# EAGLE design predkosciomierz (EAGLE 5.10)
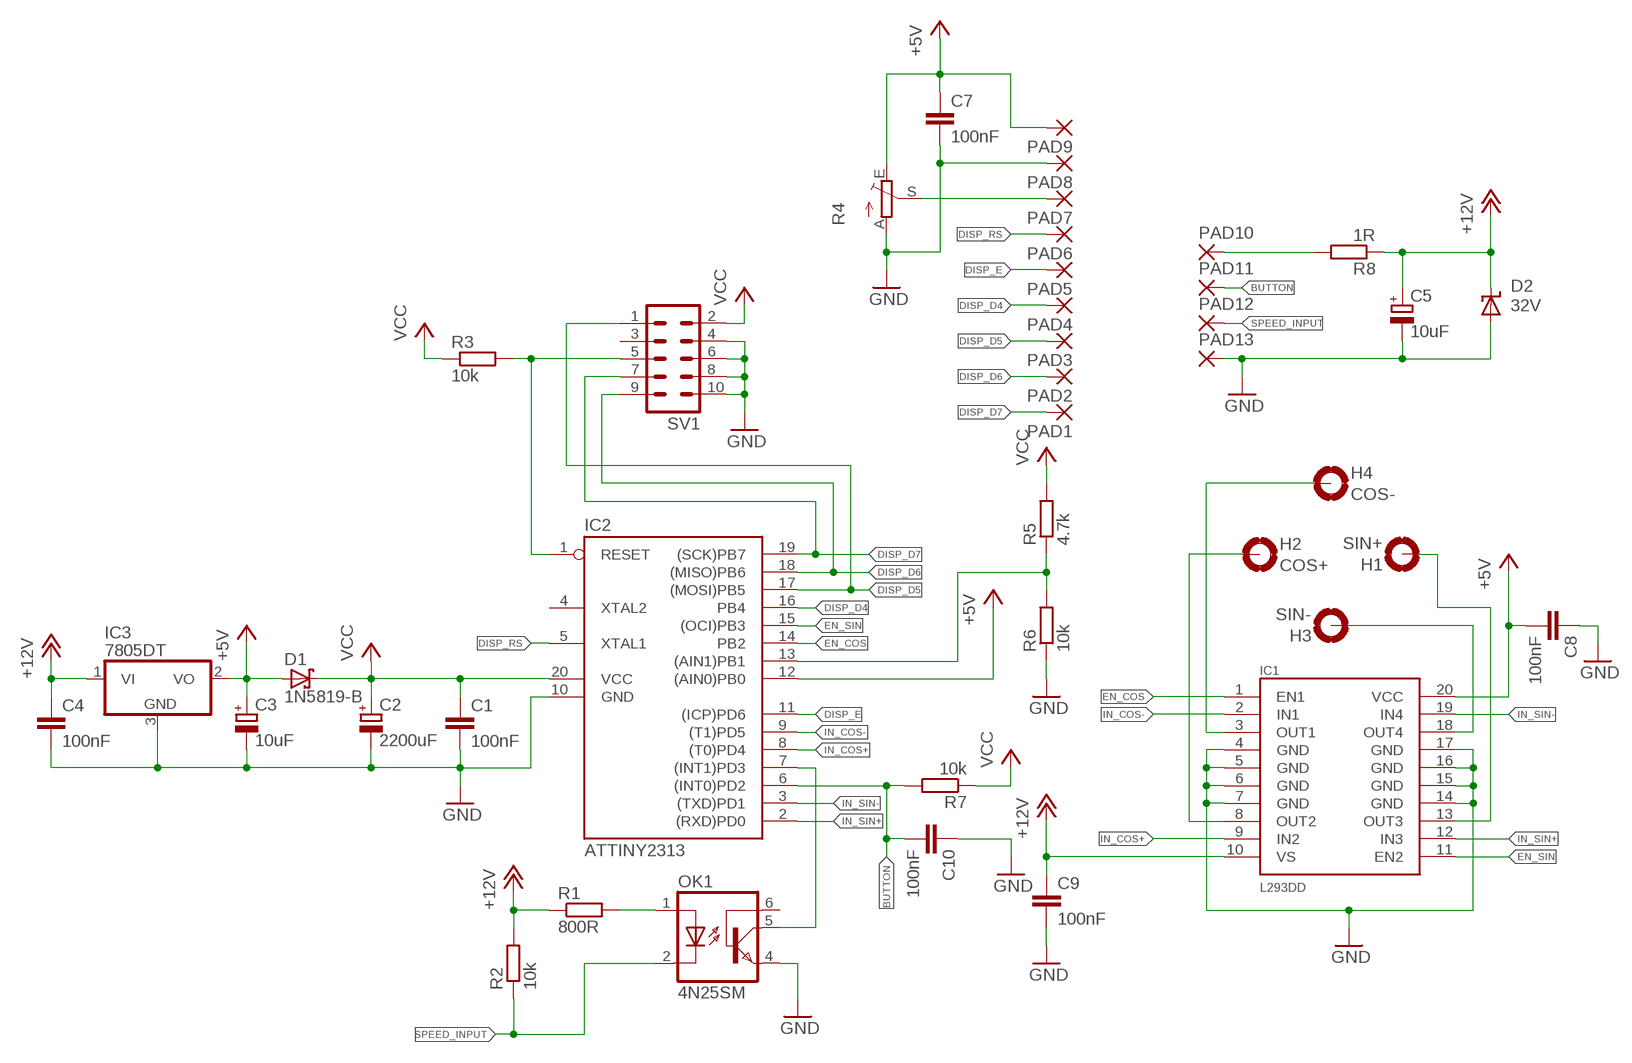
[diagram p0: schematic, sheet 1]

## Parts
C1  100nF  C-EUC0805  [C0805]
C2  2200uF  CPOL-EUE7.5-16  [E7,5-16]
C3  10uF  CPOL-EUE2.5-5  [E2,5-5]
C4  100nF  C-EUC0805  [C0805]
C5  10uF  CPOL-EUE2.5-5  [E2,5-5]
C7  100nF  C-EUC0805  [C0805]
C8  100nF  C-EUC0805  [C0805]
C9  100nF  C-EUC0805  [C0805]
C10  100nF  C-EUC0805  [C0805]
D1  1N5819-B  [DO41-7.6]
D2  32V  SUPPRESSOR-SMBJ  [SMBJ]
H1  SIN+  MOUNT-PAD-ROUND2.8  [2,8-PAD]
H2  COS+  MOUNT-PAD-ROUND2.8  [2,8-PAD]
H3  SIN-  MOUNT-PAD-ROUND2.8  [2,8-PAD]
H4  COS-  MOUNT-PAD-ROUND2.8  [2,8-PAD]
IC1  L293DD  [SO20]
IC2  ATTINY2313  AT90S2313S  [SO20L]
IC3  7805DT  [TO252]
OK1  4N25SM  [DIL6-SMD]
PAD1  WIREPAD3,17/1,2  [3,17/1,2]
PAD2  WIREPAD3,17/1,2  [3,17/1,2]
PAD3  WIREPAD3,17/1,2  [3,17/1,2]
PAD4  WIREPAD3,17/1,2  [3,17/1,2]
PAD5  WIREPAD3,17/1,2  [3,17/1,2]
PAD6  WIREPAD3,17/1,2  [3,17/1,2]
PAD7  WIREPAD3,17/1,2  [3,17/1,2]
PAD8  WIREPAD3,17/1,2  [3,17/1,2]
PAD9  WIREPAD3,17/1,2  [3,17/1,2]
PAD10  WIREPAD3,17/1,2  [3,17/1,2]
PAD11  WIREPAD3,17/1,2  [3,17/1,2]
PAD12  WIREPAD3,17/1,2  [3,17/1,2]
PAD13  WIREPAD3,17/1,2  [3,17/1,2]
R1  800R  R-EU_R0805  [R0805]
R2  10k  R-EU_R0805  [R0805]
R3  10k  R-EU_R0805  [R0805]
R4  TRIM_EU-LI10  [LI10]
R5  4.7k  R-EU_R0805  [R0805]
R6  10k  R-EU_R0805  [R0805]
R7  10k  R-EU_R0805  [R0805]
R8  1R  R-EU_R1206  [R1206]
SV1  ML10  [ML10]

## Nets
+5V: C3.+ C7.1 C8.2 D1.A IC1.20(VCC) IC2.12((AIN0)PB0) IC3.2(VO) PAD9.1(P) R4.E
+12V: C4.1 C5.+ C9.1 D2.C IC1.10(VS) IC3.1(VI) R1.1 R2.2 R8.1
BUTTON: C10.2 IC2.6((INT0)PD2) PAD11.1(P) R7.2
DISP_D4: IC2.16(PB4) PAD4.1(P)
DISP_D5: IC2.17((MOSI)PB5) PAD3.1(P) SV1.1
DISP_D6: IC2.18((MISO)PB6) PAD2.1(P) SV1.9
DISP_D7: IC2.19((SCK)PB7) PAD1.1(P) SV1.7
DISP_E: IC2.11((ICP)PD6) PAD5.1(P)
DISP_RS: IC2.5(XTAL1) PAD6.1(P)
EN_COS: IC1.1(EN1) IC2.14(PB2)
EN_SIN: IC1.11(EN2) IC2.15((OCI)PB3)
GND: C1.2 C2.- C3.- C4.2 C5.- C7.2 C8.1 C9.2 C10.1 D2.A IC1.4(GND) IC1.5(GND) IC1.6(GND) IC1.7(GND) IC1.14(GND) IC1.15(GND) IC1.16(GND) IC1.17(GND) IC2.10(GND) IC3.3(GND) OK1.4(EMI) PAD8.1(P) PAD13.1(P) R4.A R6.1 SV1.4 SV1.6 SV1.8 SV1.10
IN_COS+: IC1.9(IN2) IC2.8((T0)PD4)
IN_COS-: IC1.2(IN1) IC2.9((T1)PD5)
IN_SIN+: IC1.12(IN3) IC2.2((RXD)PD0)
IN_SIN-: IC1.19(IN4) IC2.3((TXD)PD1)
N$1: PAD10.1(P) R8.2
N$2: IC2.7((INT1)PD3) OK1.5(COL)
N$3: IC2.1(RESET) R3.2 SV1.5
N$4: PAD7.1(P) R4.S
N$5: H2.B2,8(MOUNT) IC1.8(OUT2)
N$6: OK1.1(A) R1.2
N$7: H4.B2,8(MOUNT) IC1.3(OUT1)
N$8: H3.B2,8(MOUNT) IC1.18(OUT4)
N$9: H1.B2,8(MOUNT) IC1.13(OUT3)
N$14: IC2.13((AIN1)PB1) R5.1 R6.2
SPEED_INPUT: OK1.2(C) PAD12.1(P) R2.1
VCC: C1.1 C2.+ D1.C IC2.20(VCC) R3.1 R5.2 R7.1 SV1.2
Unconnected: IC2.4(XTAL2) OK1.6(BAS) SV1.3

## Library data of the parts
C1 C4 C7-C10 = resistor:C-EU: CAPACITOR, European symbol
C2 C3 C5 = rcl:CPOL-EU: POLARIZED CAPACITOR, European symbol
D1 = diode:1N581*: 1.0A SCHOTTKY BARRIER RECTIFIER Source: http://www.diodes.com/datasheets/ds23001.pdf
D2 = diode:SUPPRESSOR-: Suppressor diode
H1-H4 = holes:MOUNT-PAD-ROUND: MOUNTING PAD, round
IC1 = moja:L293DD
IC2 = atmel:AT90S2313: MICROCONTROLLER 2 Kbytes FLASH 128 bytes SRAM 128 bytes EEPROM UART; OC_FARNELL: unknown; OC_NEWARK: unknown
IC3 = linear:78*: Positive VOLTAGE REGULATOR Source: http://cache.national.com/ds/LM/LM78L05.pdf http://www.fairchildsemi.com/ds/LM/LM7805.pdf
OK1 = optocoupler:4N*?M: General Purpose 6-Pin Phototransistor Optocouplers Source: http://www.fairchildsemi.com/ds/4N/4N35-M.pdf; MF: FAIRCHILD SEMICONDUCTOR; MPN: 4N25SM; OC_FARNELL: 1021152; OC_NEWARK: 34C2020
PAD1-PAD13 = wirepad:WIREPAD: Wire PAD connect wire on PCB
R1-R3 R5-R8 = rcl:R-EU_: RESISTOR, European symbol
R4 = pot:TRIM_EU-: POTENTIOMETER
SV1 = con-harting-ml:ML10: HARTING; OC_FARNELL: unknown; OC_NEWARK: unknown

## Board
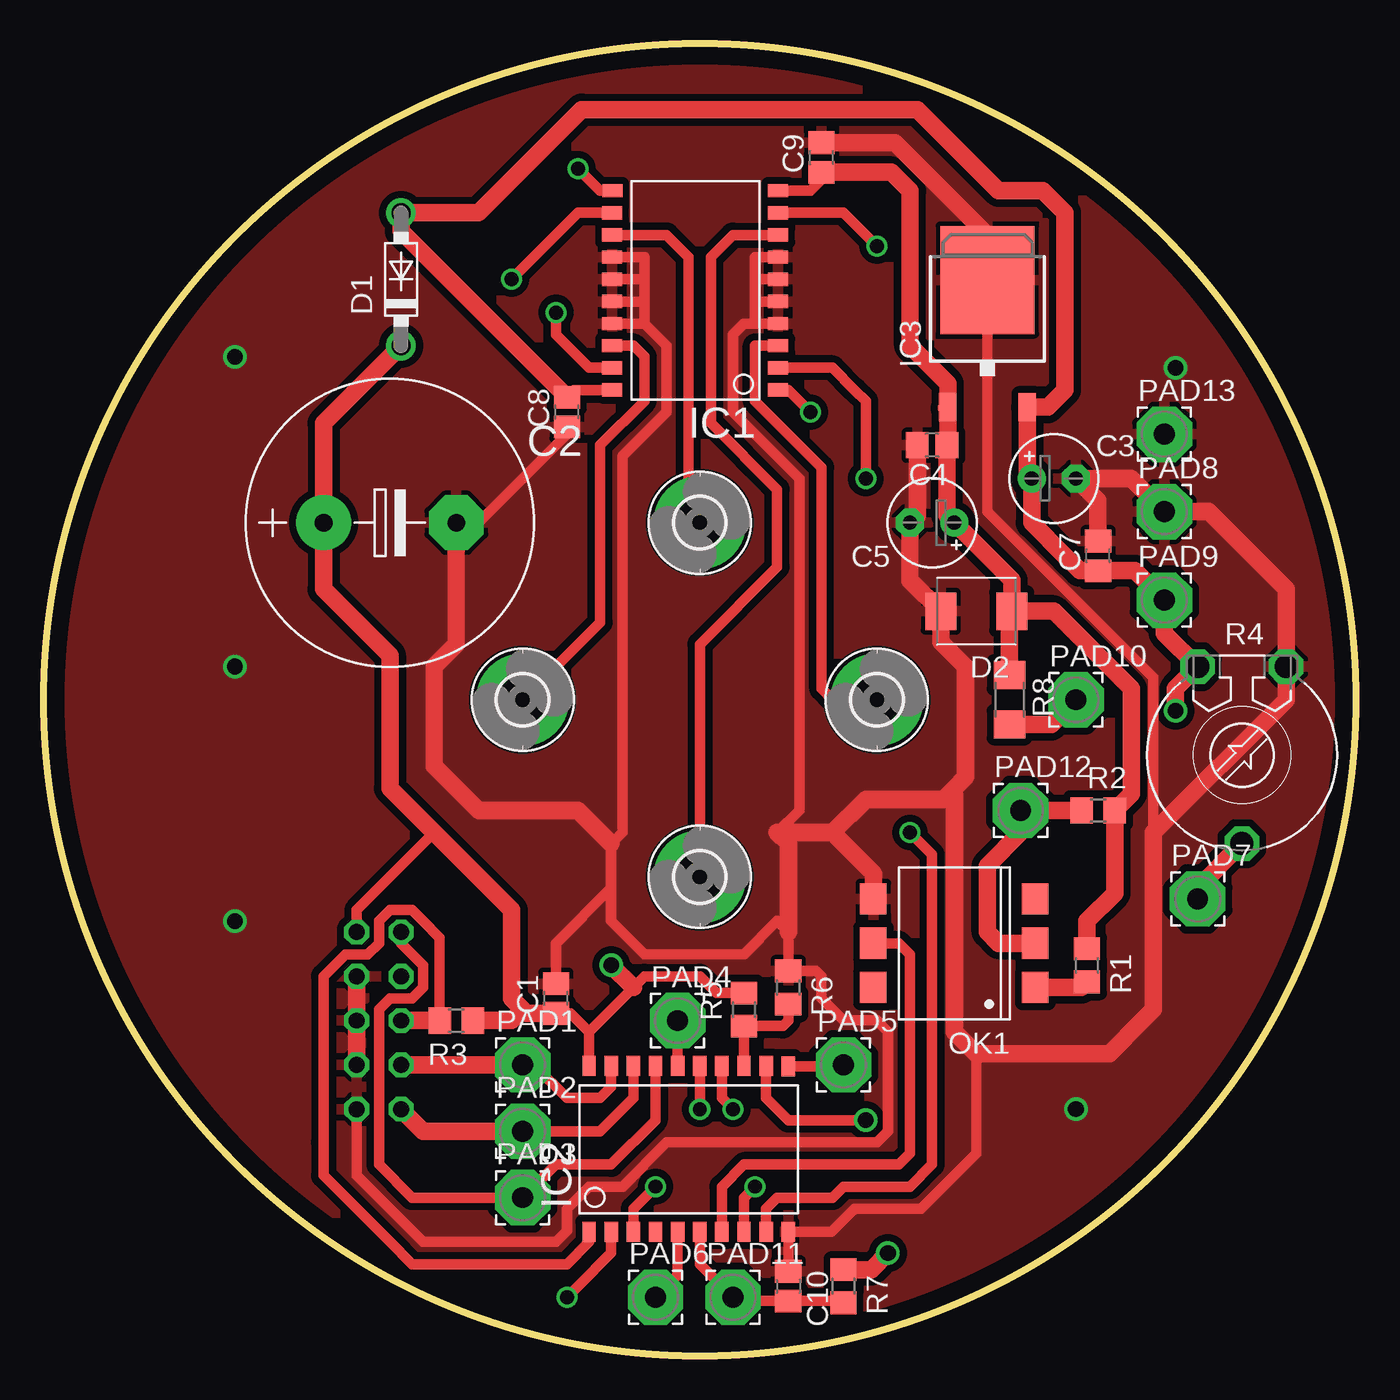
[diagram p1: board, top side]
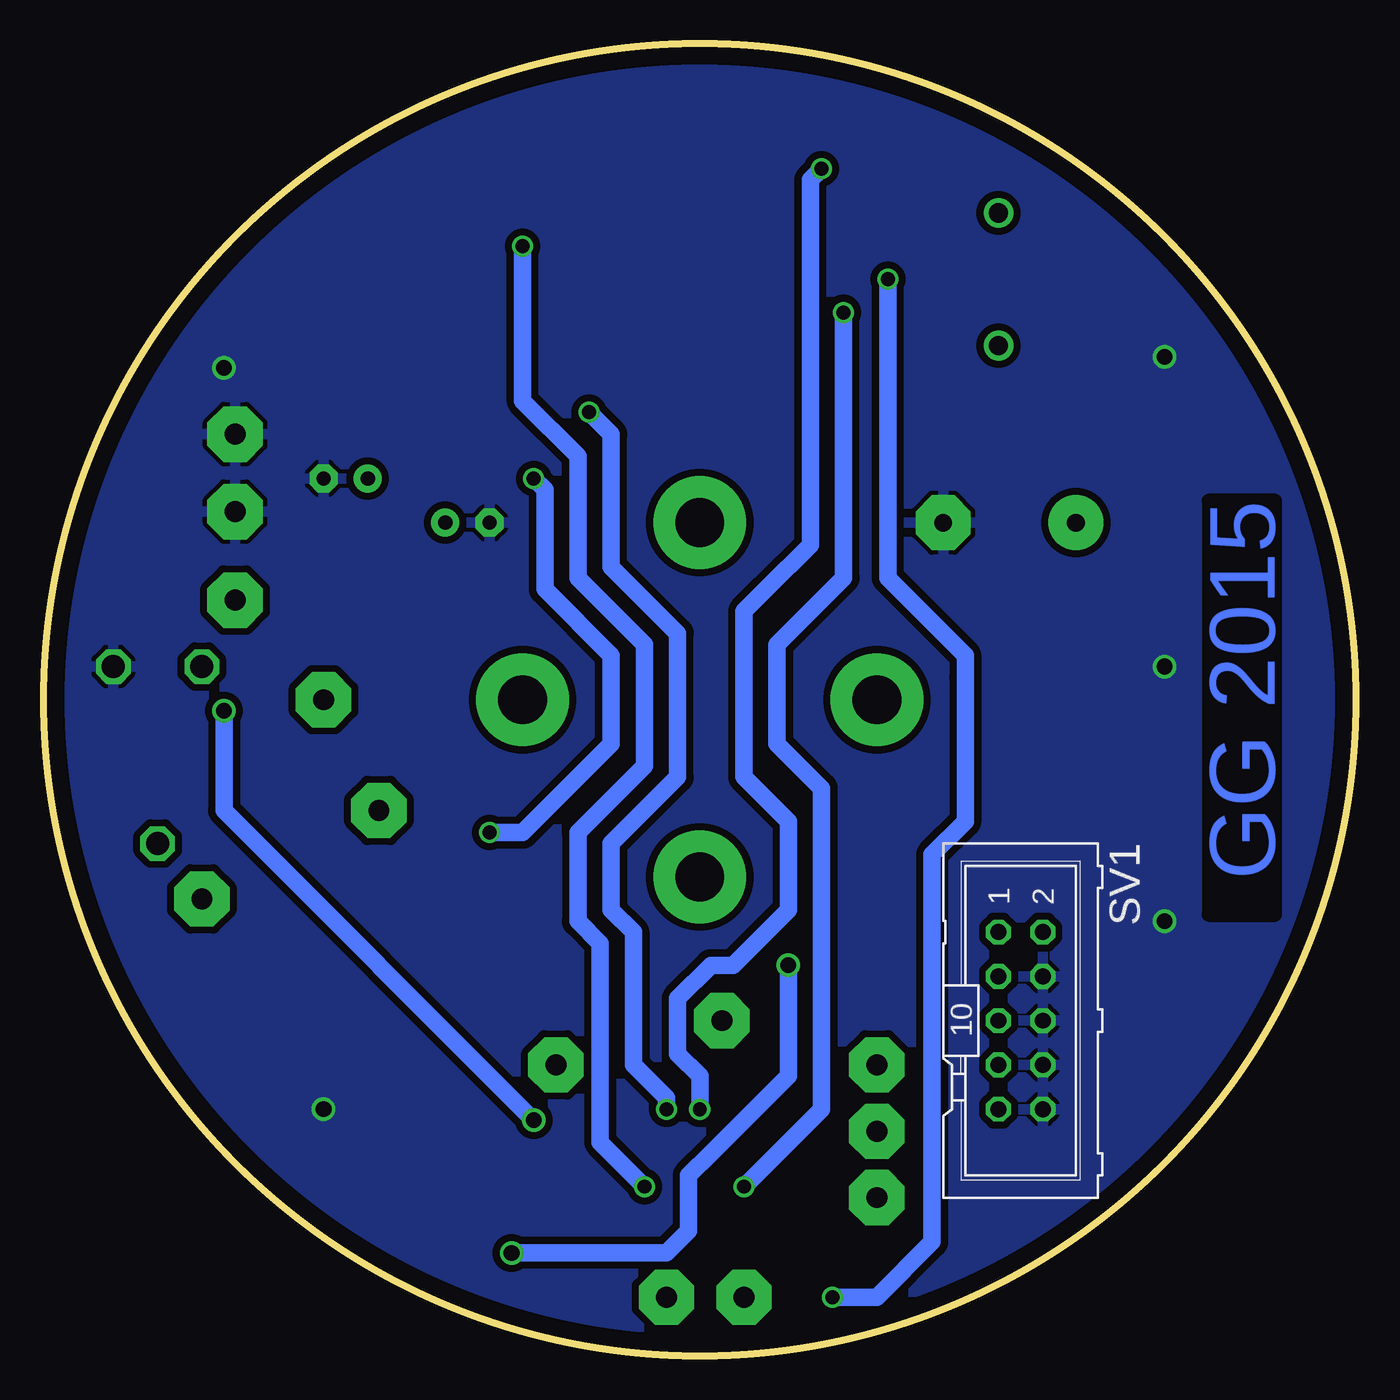
[diagram p2: board, bottom side, seen from below]

Size 75.32 x 75.32 mm. Coordinates in mm from the lower left corner, seen from the top.
Outline: circle at 37.66,37.66 radius 37.66
Copper layers (1*16): Top 0.035mm / dielectric 1.5mm / Bottom 0.035mm
Design rules "default": minimum track width 10mil, minimum drill 24mil, track to track 8mil, track to pad 8mil, pad to pad 8mil, via to via 8mil, smd to smd 8mil, copper to edge 40mil, drill to drill 8mil, minimum pad ring 10mil, minimum via ring 8mil, stop-mask expansion 4mil, vias tented up to drill 0mil, thermal gap 10mil

### Footprints (pad centres in the part's own frame; a part is rotated, then mirrored left to right if it is on the bottom)
C0805 = smd 1.3 x 1.5: 1 -0.85,0; 2 0.85,0
E7,5-16 = drill 1.016 pad 3.15 round: + -3.81,0 | drill 1.016 pad 3.15 octagon: - 3.81,0
E2,5-5 = drill 0.813 pad 1.6 round: + -1.27,0 | drill 0.813 pad 1.6 octagon: - 1.27,0
DO41-7.6 = drill 1.1 pad 1.7 round: A 3.81,0; C -3.81,0
SMBJ = smd 1.78 x 2.16: A 2.04,0; C -2.03,0
2,8-PAD = drill 2.8 pad 5.334 round: B2,8 0,0
SO20 = smd 0.762 x 1.143: 1 -5.08,-5.131; 2 -3.81,-5.131; 3 -2.54,-5.131; 4 -1.27,-5.131; 5 0,-5.131; 6 1.27,-5.131; 7 2.54,-5.131; 8 3.81,-5.131; 9 5.08,-5.131; 10 6.35,-5.131; 11 6.35,4.369; 12 5.08,4.394; 13 3.81,4.394; 14 2.54,4.394; 15 1.27,4.394; 16 0,4.394; 17 -1.27,4.394; 18 -2.54,4.394; 19 -3.81,4.394; 20 -5.08,4.394
SO20L = smd 0.762 x 1.143: 1 -5.08,-5.131; 2 -3.81,-5.131; 3 -2.54,-5.131; 4 -1.27,-5.131; 5 0,-5.131; 6 1.27,-5.131; 7 2.54,-5.131; 8 3.81,-5.131; 9 5.08,-5.131; 10 6.35,-5.131; 11 6.35,4.369; 12 5.08,4.394; 13 3.81,4.394; 14 2.54,4.394; 15 1.27,4.394; 16 0,4.394; 17 -1.27,4.394; 18 -2.54,4.394; 19 -3.81,4.394; 20 -5.08,4.394
TO252 = smd 1 x 1.6: 1 -2.28,-4.8; 2 2.28,-4.8 | smd 5.4 x 6.2: 3 0,2.5
DIL6-SMD = smd 1.78 x 1.52: 1 -2.54,-4.645; 2 0,-4.645; 3 2.54,-4.645; 4 2.54,4.645; 5 0,4.645; 6 -2.54,4.645
3,17/1,2 = drill 1.194 pad 3.175 octagon: 1 0,0
R0805 = smd 1.3 x 1.5: 1 -0.95,0; 2 0.95,0
LI10 = drill 1.321 octagon: A -2.54,-5.08; E 2.54,-5.08; S 0,5.08
R1206 = smd 1.6 x 1.803: 1 -1.422,0; 2 1.422,0
ML10 = drill 0.914 octagon: 1 -5.08,-1.27; 2 -5.08,1.27; 3 -2.54,-1.27; 4 -2.54,1.27; 5 0,-1.27; 6 0,1.27; 7 2.54,-1.27; 8 2.54,1.27; 9 5.08,-1.27; 10 5.08,1.27

### Placement (x,y rotation side)
C1  29.4,20.51 90 top
C2  19.88,47.82 0 top
C3  57.98,50.36 0 top
C4  50.99,52.26 180 top
C5  50.99,47.82 180 top
C7  60.52,45.91 90 top
C8  30.04,54.17 90 top
C9  44.64,68.77 90 top
C10  42.74,4 270 top
D1  20.51,61.79 90 top
D2  53.53,42.74 180 top
H1  37.66,47.82 0 top
H2  37.66,27.5 0 top
H3  27.5,37.66 0 top
H4  47.82,37.66 0 top
IC1  37.02,60.52 90 top
IC2  36.39,12.26 0 top
IC3  54.17,59.25 0 top
OK1  52.26,23.69 90 top
PAD1  27.5,16.7 0 top
PAD2  27.5,12.89 0 top
PAD3  27.5,9.08 0 top
PAD4  36.39,19.24 0 top
PAD5  45.91,16.7 0 top
PAD6  35.12,3.37 0 top
PAD7  66.23,26.23 0 top
PAD8  64.33,48.45 0 top
PAD9  64.33,43.37 0 top
PAD10  59.25,37.66 0 top
PAD11  39.56,3.37 0 top
PAD12  56.07,31.31 0 top
PAD13  64.33,52.9 0 top
R1  59.88,22.42 270 top
R2  60.52,31.31 0 top
R3  23.69,19.24 180 top
R4  68.77,34.48 180 top
R5  40.2,19.88 90 top
R6  42.74,21.15 270 top
R7  45.91,4 270 top
R8  55.44,37.66 270 top
SV1  19.24,19.24 270 bottom

### Tracks (layer width: path | path; a pad name or v marks a point on that pad's centre or on a via)
+5V  (via drill 0.9)
  Top 0.61: IC2.12 41.47,14.8 42.74,13.53 v47.18,13.53 | C8.2 30.46,55.44 IC1.20
  Top 1.016: v64.96,37.02 64.96,38.29 R4.E 64.33,41.47 PAD9.1 62.64,45.06 C7.1 59.46,45.06 58.61,45.91 56.71,47.82 C3.+ 56.45,50.62 IC3.2 57.62,54.45 57.98,54.8 58.61,55.44 58.61,65.6 57.34,66.87 54.8,66.87 50.14,71.53 30.89,71.53 26.23,66.87 24.96,65.6 D1.A 20.51,64.54 C8.2
  Bottom 1.016: v47.18,13.53 64.96,31.31 v64.96,37.02
+12V
  Top 0.61: IC1.10 44.01,66.87 44.64,67.5 C9.1
  Top 1.016: IC3.1 51.82,54.38 | D2.C 55.56,44.52 C5.+ 51.84,48.24 C4.1 51.89,52.31 IC3.1 | R8.1 55.44,42.61 D2.C | D2.C 57.98,42.74 62.42,38.29 62.42,32.26 R2.2 61.47,26.54 59.88,24.96 R1.1 | IC3.1 51.89,55.81 49.72,57.98 49.72,66.87 48.67,67.92 C9.1
BUTTON
  Top 0.61: IC2.6 37.66,5.27 PAD11.1 39.78,3.15 C10.2 45.81,3.15 R7.2
DISP_D4
  Top 0.61: PAD4.1 IC2.16
DISP_D5
  Top 0.61: IC2.17 35.12,13.53 32.58,10.99 29.4,10.99 PAD3.1 21.15,9.08 19.24,10.99 19.24,19.88 19.88,20.51 21.15,20.51 21.78,21.15 21.78,22.42 21.15,23.05 20.51,23.69 SV1.1
DISP_D6
  Top 0.61: PAD2.1 31.94,12.89 33.85,14.8 IC2.18
  Top 1.016: SV1.9 21.78,12.89 PAD2.1
DISP_D7
  Top 0.61: PAD1.1 28.13,16.7 30.04,14.8 31.94,14.8 32.58,15.43 IC2.19
  Top 1.016: PAD1.1 SV1.7
DISP_E
  Top 0.61: PAD5.1 45.84,16.63 IC2.11
DISP_RS
  Top 0.61: PAD6.1 36.39,4.64 IC2.5
EN_COS  (via drill 0.8)
  Top 0.61: IC2.14 38.93,14.8 v39.56,14.16 | v44.01,54.17 42.74,55.44 IC1.1
  Bottom 1.016: v39.56,14.16 39.56,14.8 41.47,16.7 41.47,24.32 42.74,25.59 42.74,29.4 38.93,33.21 38.93,41.47 42.74,45.28 42.74,52.9 v44.01,54.17
EN_SIN  (via drill 0.8)
  Top 0.61: IC1.11 31.94,66.87 v30.67,68.14 | v37.66,14.16 IC2.15
  Bottom 1.016: v30.67,68.14 31.31,67.5 31.31,46.55 33.85,44.01 35.12,42.74 35.12,33.21 32.58,30.67 32.58,25.59 35.75,22.42 37.02,22.42 38.93,20.51 38.93,17.34 37.66,16.07 v37.66,14.16
GND  (via drill 0.9)
  Top 0.61: 32.58,26.86 32.58,24.96 34.48,23.05 38.93,23.05 40.2,23.05 42.1,24.96 42.74,24.32 R6.1 44.33,22.1 44.64,21.78 44.64,20.51 45.91,19.24 47.82,19.24 48.45,18.61 48.45,17.34 48.45,12.89 47.82,12.26 46.55,12.26 35.75,12.26 33.21,9.72 31.31,9.72 30.04,8.45 30.04,7.18 29.4,6.54 21.78,6.54 17.97,10.35 SV1.10 | 32.58,26.86 32.58,29.4 33.21,30.04 33.21,51.63 35.75,54.17 35.75,57.98 34.48,59.25 | C1.2 29.4,23.69 32.58,26.86 | C10.1 IC2.10 45.23,7.13 46.55,8.45 50.36,8.45 53.53,11.62 53.53,17.34 | 34.48,60.52 IC1.16 | 34.48,59.25 34.48,60.52 | 34.48,59.25 IC1.17 | 34.48,61.79 IC1.15 | 34.48,60.52 34.48,61.79 | 34.48,63.06 IC1.14 | 34.48,63.06 34.48,61.79 | IC1.7 40.83,63.06 40.83,61.79 | 40.83,59.25 40.83,60.52 | 40.83,60.52 40.83,61.79 | 40.83,59.25 IC1.4 | 40.83,61.79 IC1.6 | 40.83,60.52 IC1.5 | 34.48,59.25 34.48,63.06 | 40.83,59.25 40.2,59.25 39.56,58.61 39.56,54.17 43.37,50.36 43.37,31.31 42.1,30.04 | IC3.3 54.17,48.45 59.25,43.37 63.69,38.93 63.69,30.04 | C8.1 30.04,52.9 24.96,47.82 C2.-
  Top 1.016: C4.2 50.14,48.24 C5.- 49.72,44.64 49.72,44.51 D2.A 51.49,40.97 52.9,39.56 52.9,33.21 52.26,32.58 | OK1.4 47.62,27.7 47.5,27.82 45.28,30.04 | C7.2 60.52,49.09 C3.- 62.42,50.36 PAD8.1 66.87,48.45 71.31,44.01 R4.A 71.31,37.66 63.69,30.04 63.69,19.88 63.06,19.24 61.15,17.34 53.53,17.34 52.26,18.61 52.26,32.58 | C2.- 23.69,40.83 22.42,39.56 22.42,33.85 24.96,31.31 30.67,31.31 32.58,29.4 | IC3.3 54.17,64.33 48.87,69.62 C9.2 | SV1.4 SV1.6 SV1.8 | 45.28,30.04 47.18,31.94 51.63,31.94 52.26,32.58 | 45.28,30.04 42.1,30.04 42.74,29.4 42.74,24.32
  other vias: 64.96,56.71 59.25,14.16 10.99,57.34 10.99,39.56 10.99,24.96
  pour Bottom (isolate 0.406): -4.25,77.66 76.39,77.66 76.39,-7.43 -4.25,-7.43
  pour Top (isolate 0.406): -2.35,76.39 77.03,76.39 77.03,-4.89 -2.35,-4.89
IN_COS+  (via drill 0.8)
  Top 0.61: IC2.8 40.2,9.08 v40.83,9.72 | v47.82,63.69 45.91,65.6 IC1.9
  Bottom 1.016: v40.83,9.72 43.37,12.26 43.37,17.97 43.37,23.69 44.64,24.96 44.64,30.04 40.83,33.85 40.83,40.83 44.64,44.64 44.64,51.63 47.82,54.8 v47.82,63.69
IN_COS-  (via drill 0.8)
  Top 0.61: IC1.2 45.28,56.71 46.55,55.44 47.18,54.8 v47.18,50.36 | IC2.9 41.47,8.45 42.1,9.08 44.64,9.08 45.28,9.08 45.91,9.72 49.72,9.72 50.99,10.99 50.99,28.77 v49.72,30.04
  Bottom 1.016: v47.18,50.36 46.55,49.72 46.55,44.01 42.74,40.2 42.74,35.12 47.82,30.04 v49.72,30.04
IN_SIN+  (via drill 0.8)
  Top 0.61: IC2.2 32.58,5.91 30.67,4 v30.04,3.37 | v26.86,61.79 30.67,65.6 IC1.12
  Bottom 1.016: v30.04,3.37 27.5,3.37 24.32,6.54 24.32,19.24 24.32,28.77 22.42,30.67 22.42,38.93 22.42,40.2 26.86,44.64 26.86,56.71 v26.86,61.79
IN_SIN-  (via drill 0.8)
  Top 0.61: IC2.3 33.85,8.45 v35.12,9.72 | v29.4,59.88 29.4,58.61 31.31,56.71 IC1.19
  Bottom 1.016: v35.12,9.72 30.67,14.16 30.67,24.32 30.67,32.58 33.21,35.12 33.21,40.83 29.4,44.64 v29.4,59.88
N$1
  Top 1.016: R8.2 57.83,36.24 PAD10.1
N$2
  Top 0.61: IC2.7 38.93,9.72 40.2,10.99 47.18,10.99 49.09,10.99 49.72,11.62 49.72,23.05 49.09,23.69 OK1.5
N$3
  Top 0.61: 31.31,6.54 IC2.1 31.31,6.54 | R3.2 22.74,24 21.78,24.96 21.15,25.59 20.51,25.59 19.88,25.59 19.24,24.96 19.24,24.32 19.24,23.69 18.61,23.05 17.34,23.05 16.07,21.78 16.07,12.26 16.07,10.35 19.88,6.54 21.15,5.27 30.04,5.27 31.31,6.54
  Top 1.016: R3.2 SV1.5
N$4
  Top 1.016: PAD7.1 66.23,26.86 R4.S
N$5
  Top 0.61: H2.B2,8 37.66,40.83 42.1,45.28 42.1,49.72 38.29,53.53 38.29,63.06 39.56,64.33 IC1.8
N$6
  Top 1.016: OK1.1 59.56,21.15 R1.2
N$7
  Top 0.61: H4.B2,8 45.28,37.66 44.64,38.29 44.64,50.99 40.83,54.8 40.83,57.98 IC1.3
N$8
  Top 0.61: H3.B2,8 31.94,42.1 31.94,52.26 34.48,54.8 34.48,57.34 33.85,57.98 IC1.18
N$9
  Top 0.61: IC1.13 35.12,64.33 35.75,64.33 37.02,63.06 37.02,48.45 H1.B2,8
N$14
  Top 0.61: IC2.13 R5.1 42.42,18.93 42.74,19.24 R6.2
SPEED_INPUT
  Top 1.016: R2.1 PAD12.1 56.07,30.04 54.17,28.13 54.17,24.32 54.8,23.69 OK1.2
VCC  (via drill 0.9)
  Top 0.61: 31.31,18.61 IC2.20 | 31.31,18.61 30.25,19.66 C1.1 | SV1.2 17.97,24.96 17.97,25.59 22.42,30.04 | R5.2 38.61,20.83 37.66,21.78 34.48,21.78 33.85,21.15 31.31,18.61
  Top 1.016: 27.5,19.88 26.86,20.51 26.86,25.59 23.69,28.77 22.42,30.04 19.88,32.58 19.88,40.2 16.07,44.01 C2.+ 16.07,53.53 D1.C | 27.5,19.88 27.71,19.66 C1.1 | R3.1 26.86,19.24 27.5,19.88 | 33.85,21.15 v32.58,22.42 | R7.1 47.5,4.95 v48.45,5.91
  Bottom 1.016: v48.45,5.91 39.56,5.91 38.29,7.18 38.29,10.35 37.02,11.62 32.58,16.07 v32.58,22.42

### Text on the board
Bottom: GG 2015